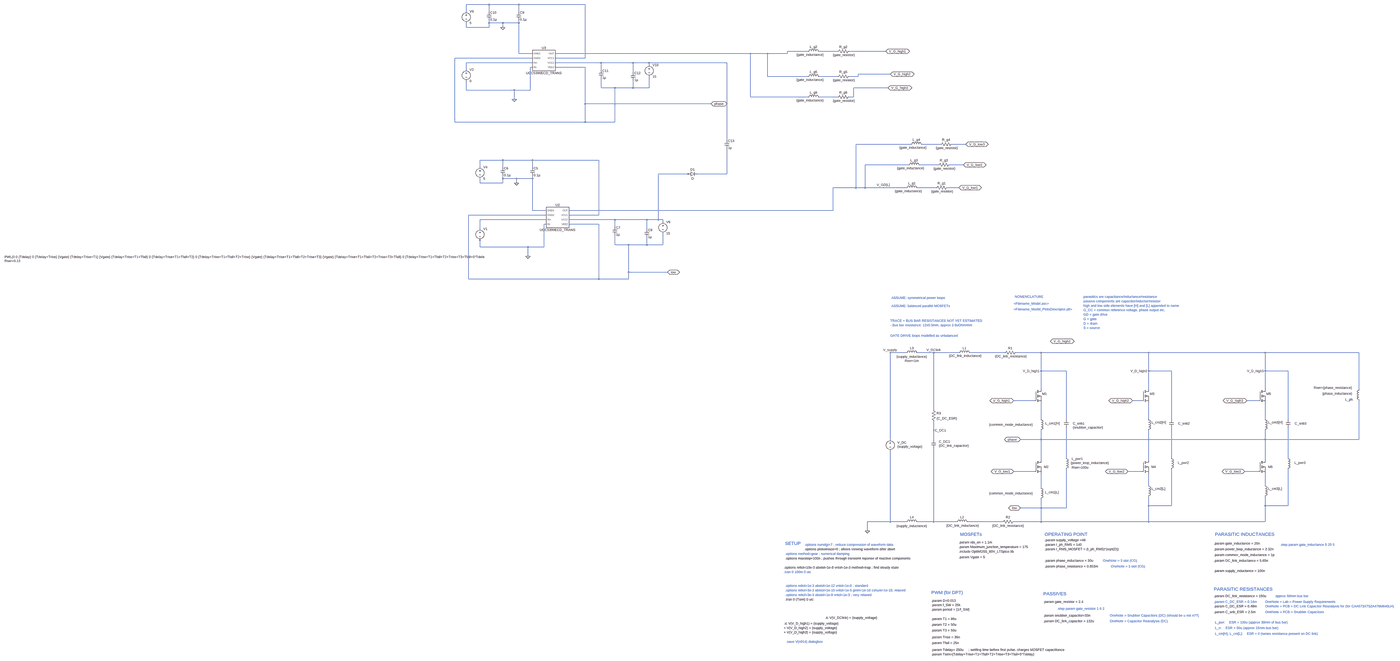
[diagram p0: schematic double_pulse_setup_including_gate_driver_circuitry_isolatedgrounds.asc, whole sheet]
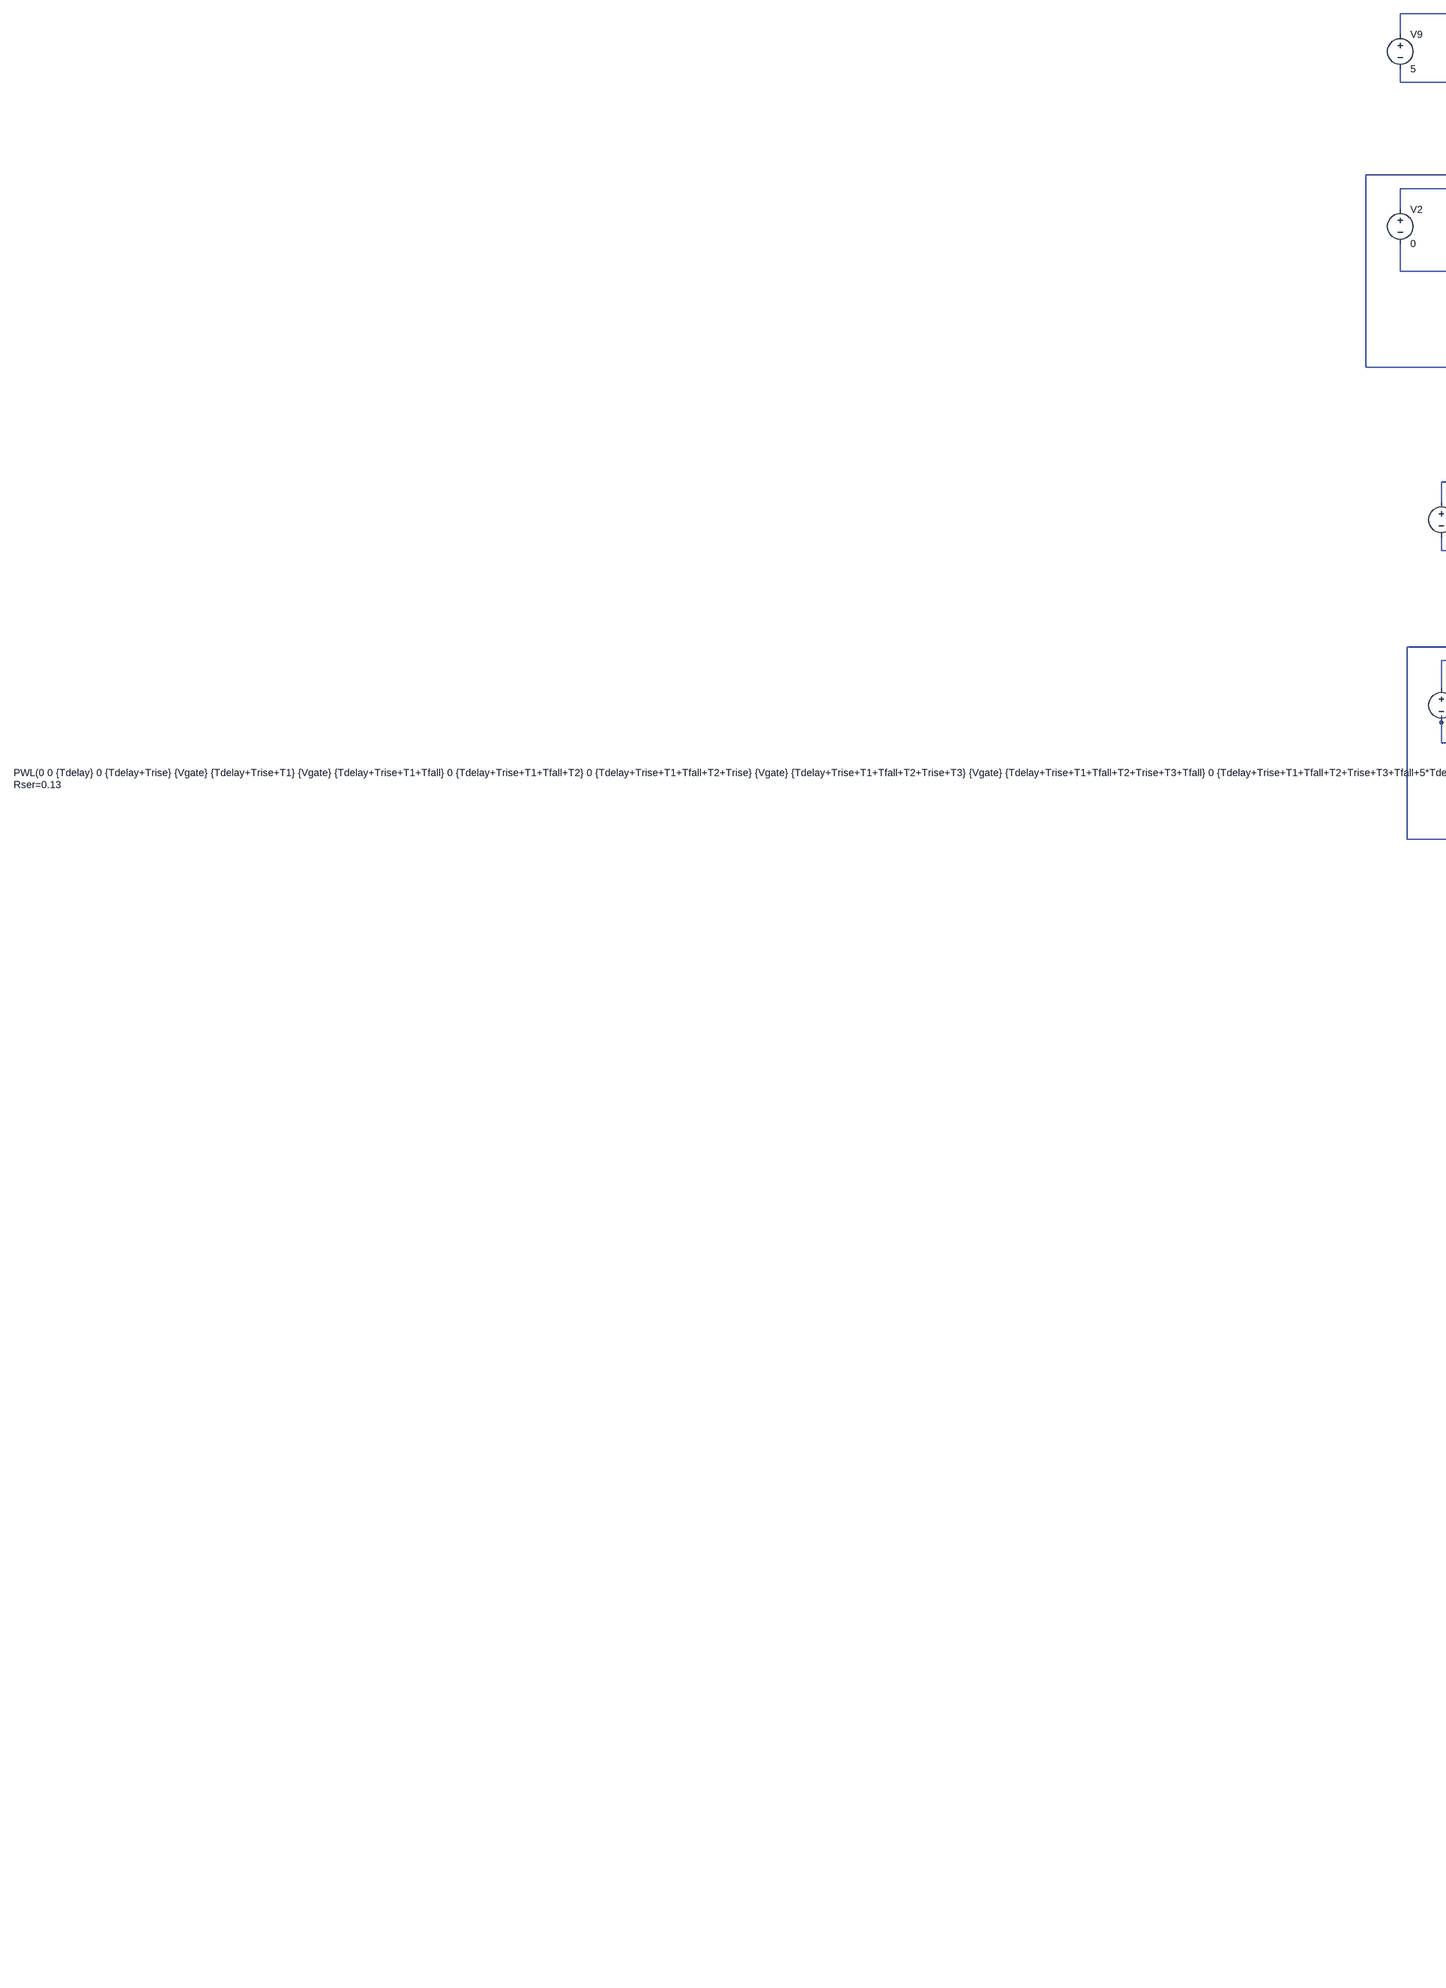
[diagram p1: schematic double_pulse_setup_including_gate_driver_circuitry_isolatedgrounds.asc, part, row 1 of 1, column 1 of 3]
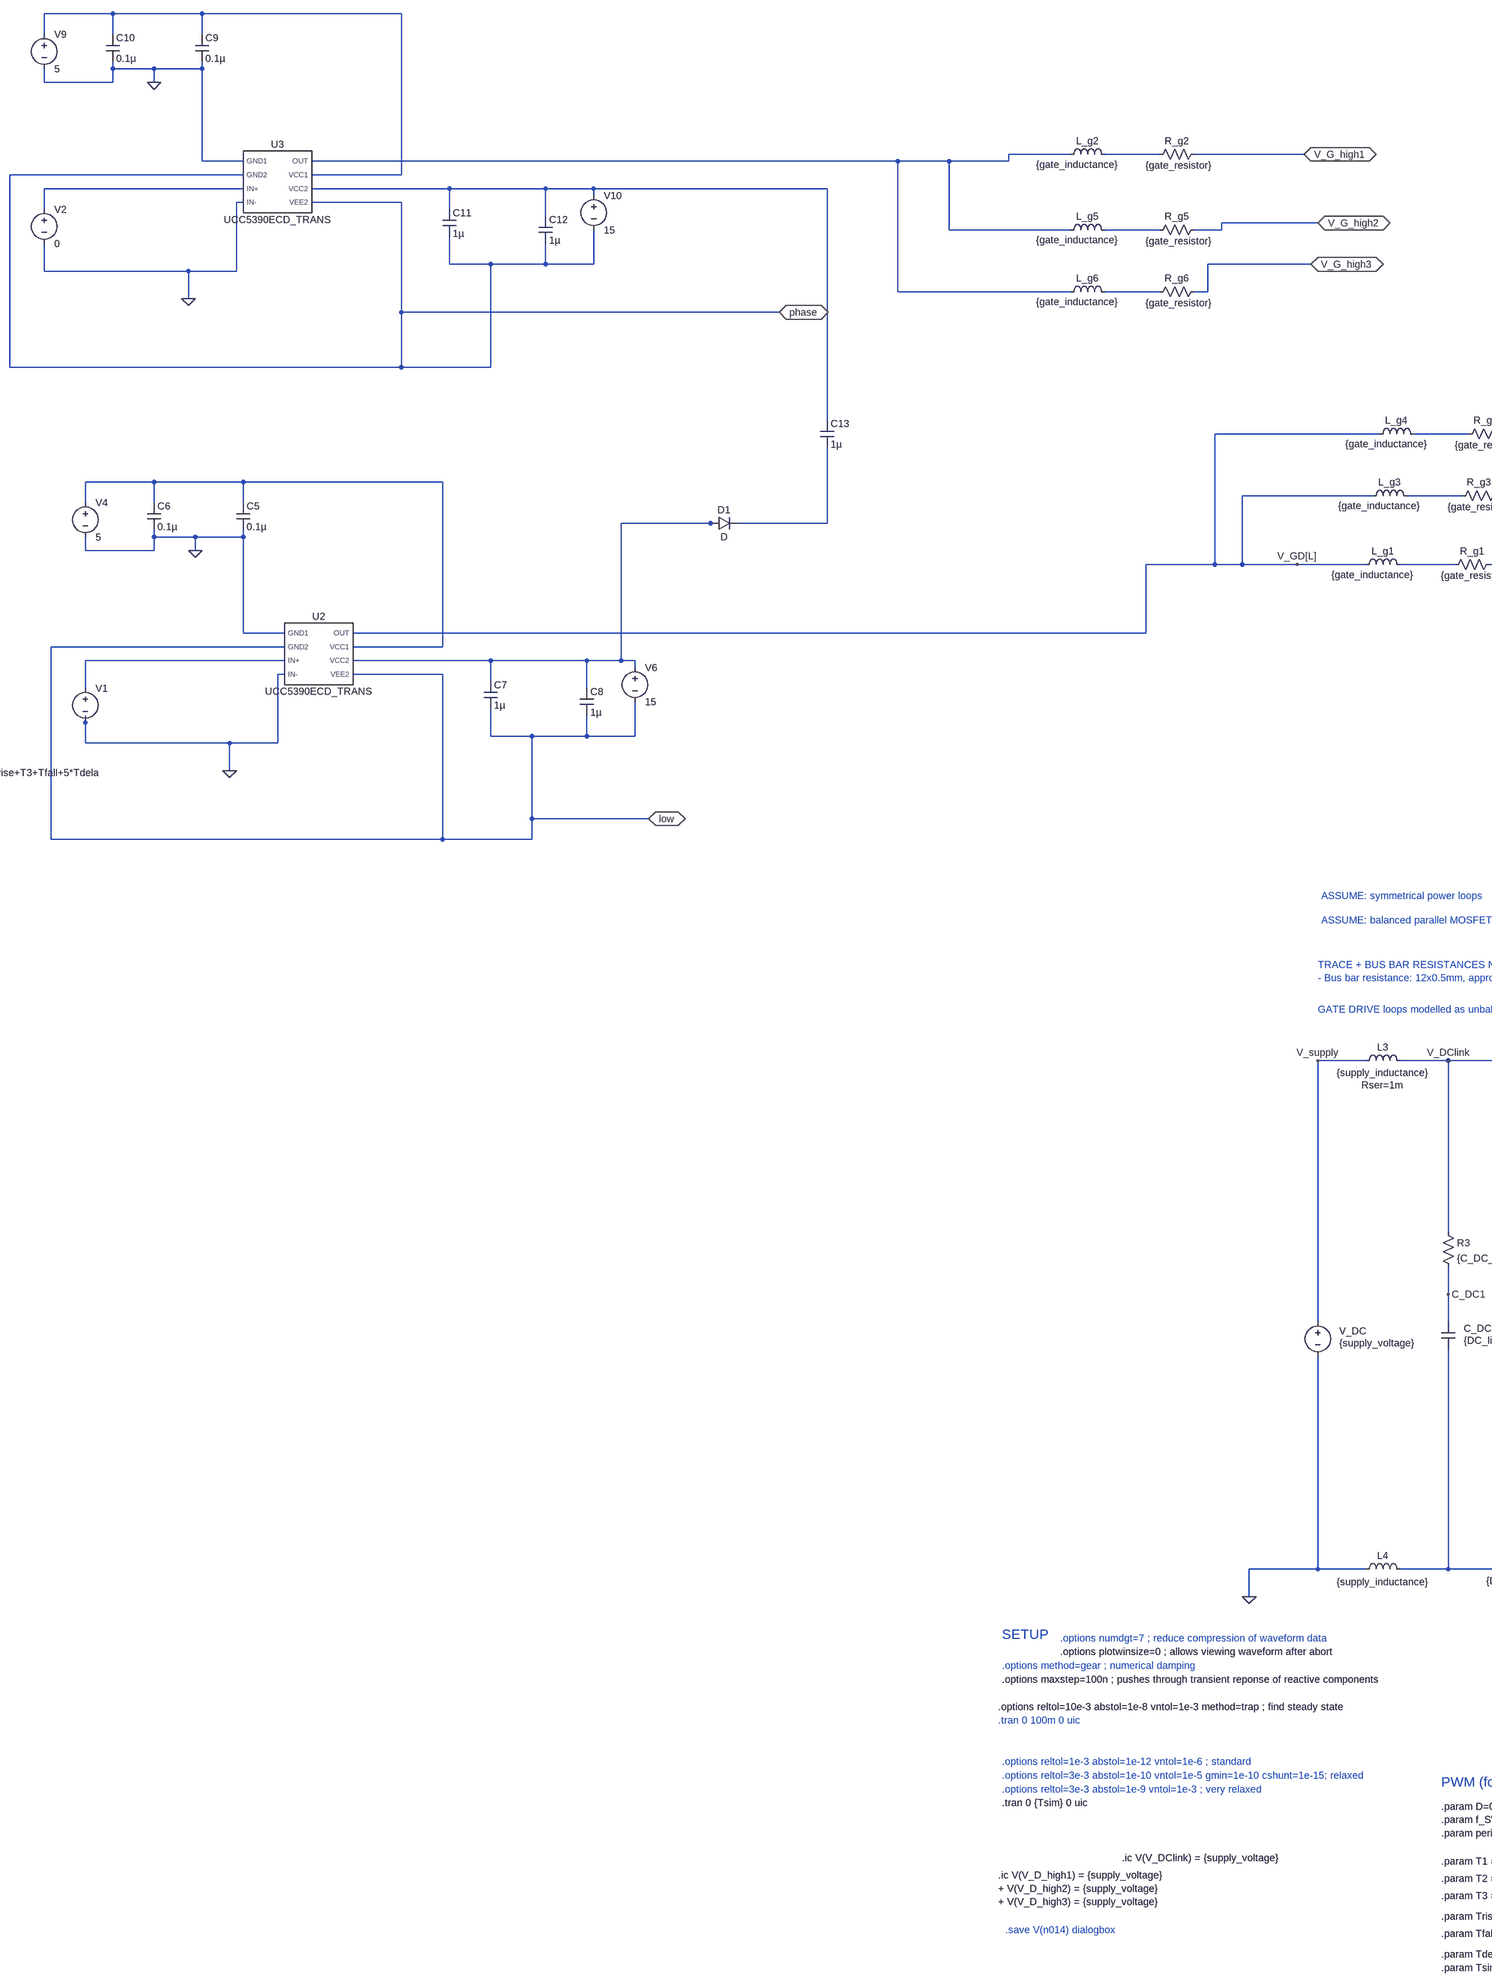
[diagram p2: schematic double_pulse_setup_including_gate_driver_circuitry_isolatedgrounds.asc, part, row 1 of 1, column 2 of 3]
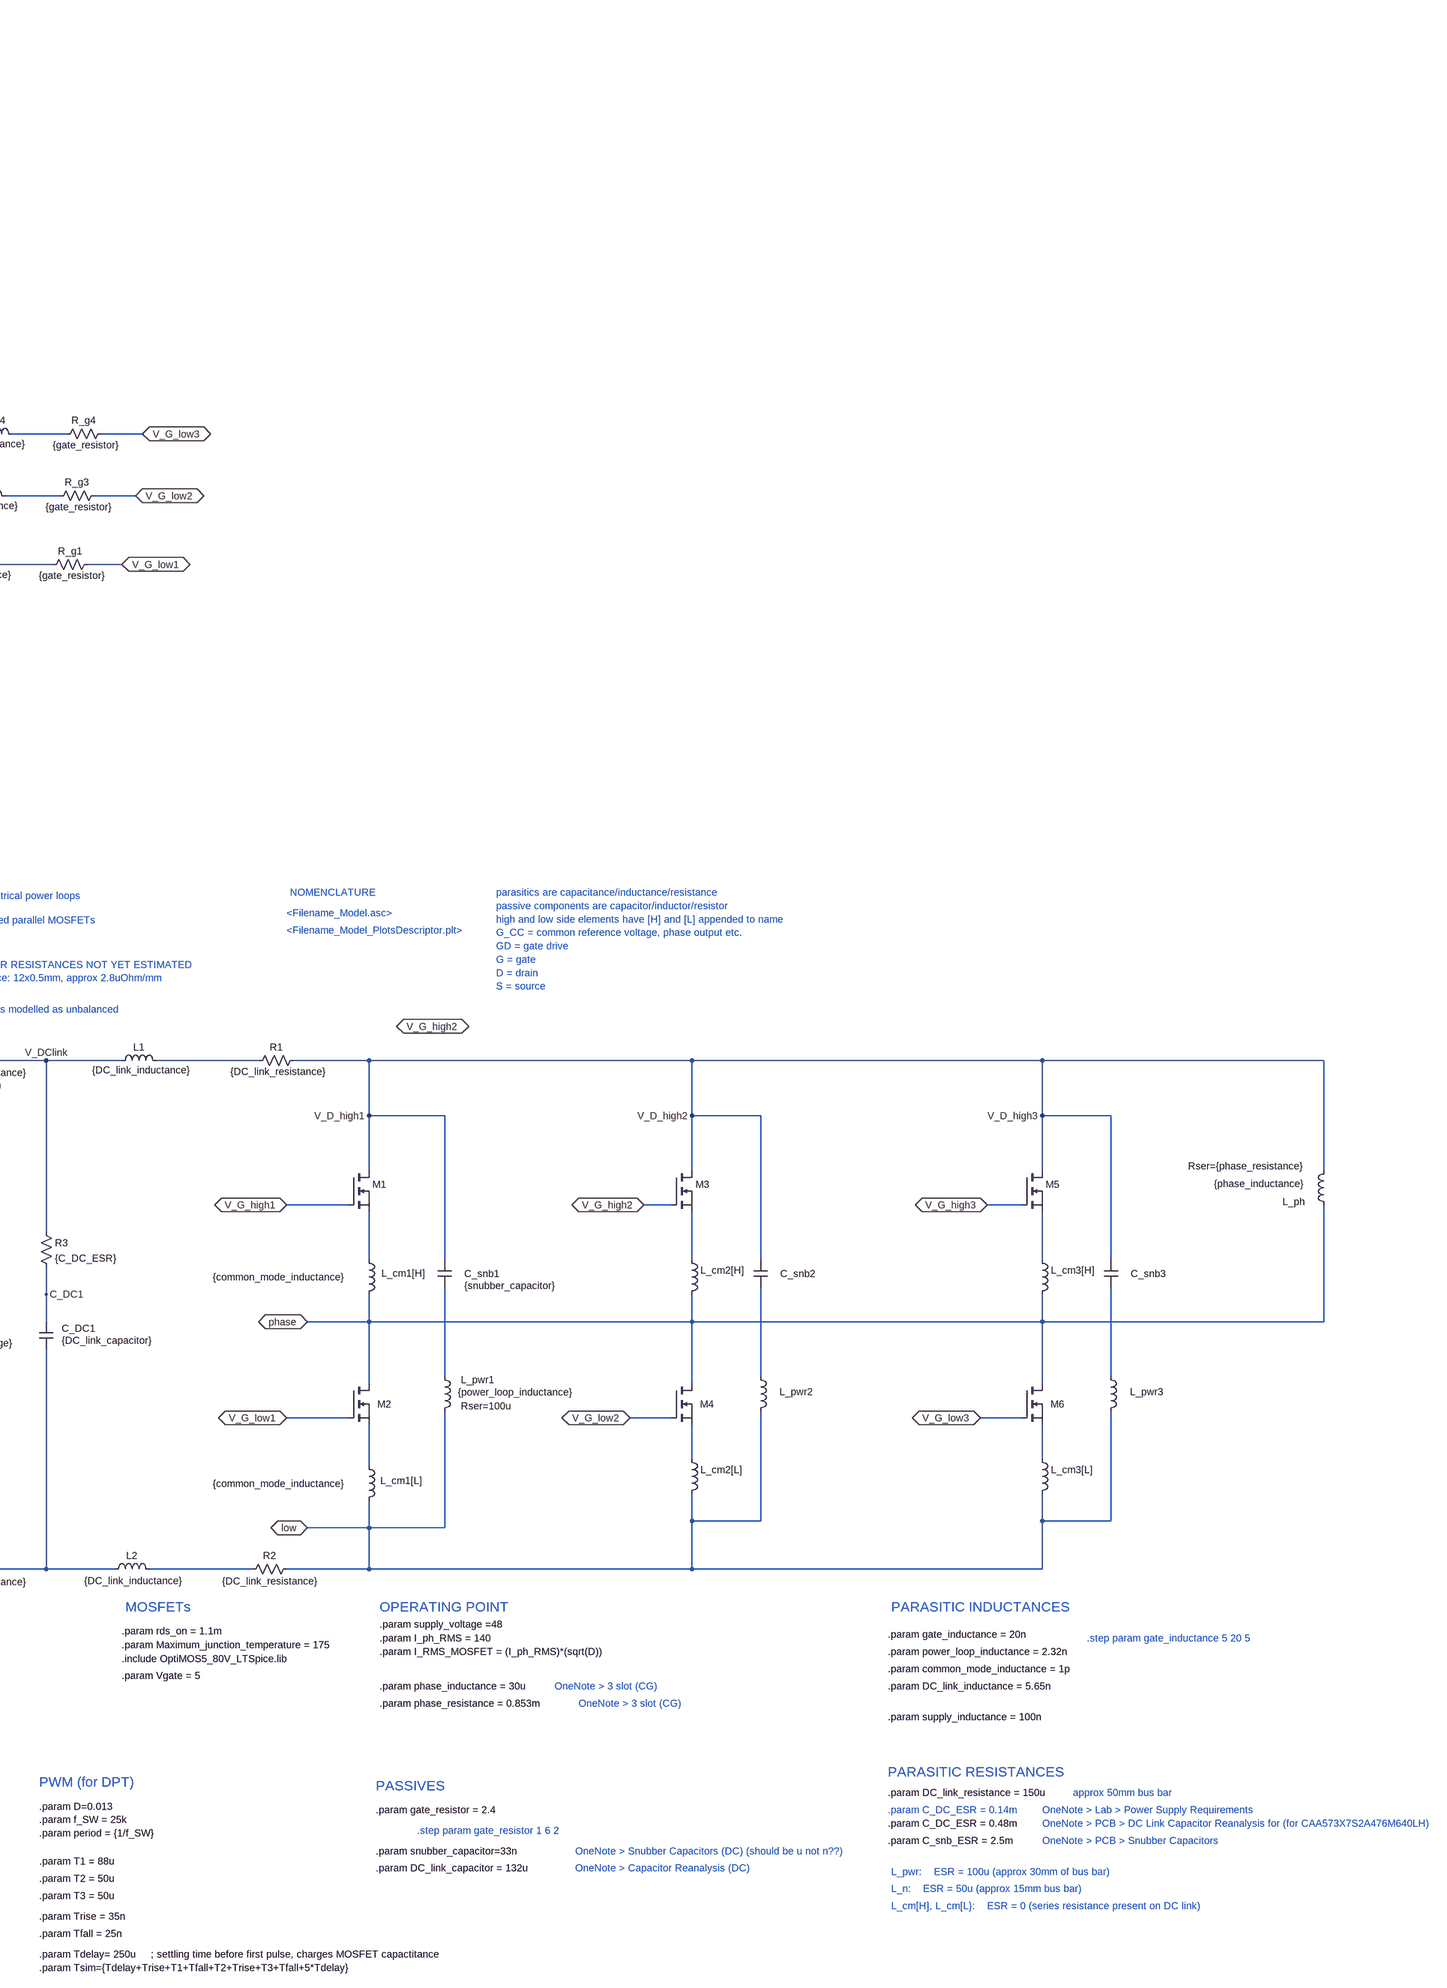
[diagram p3: schematic double_pulse_setup_including_gate_driver_circuitry_isolatedgrounds.asc, part, row 1 of 1, column 3 of 3]
double_pulse_setup_including_gate_driver_circuitry_isolatedgrounds.asc, the LTspice schematic file:
Version 4.1
SHEET 1 7948 3392
WIRE -1856 -3680 -2016 -3680
WIRE -1648 -3680 -1856 -3680
WIRE -1184 -3680 -1648 -3680
WIRE -2016 -3632 -2016 -3680
WIRE -1856 -3632 -1856 -3680
WIRE -1648 -3632 -1648 -3680
WIRE -1856 -3552 -1856 -3568
WIRE -1760 -3552 -1856 -3552
WIRE -1648 -3552 -1648 -3568
WIRE -1648 -3552 -1760 -3552
WIRE -2016 -3520 -2016 -3552
WIRE -1856 -3520 -1856 -3552
WIRE -1856 -3520 -2016 -3520
WIRE -1760 -3520 -1760 -3552
WIRE 448 -3344 304 -3344
WIRE 656 -3344 528 -3344
WIRE 992 -3344 736 -3344
WIRE -1648 -3328 -1648 -3552
WIRE -1552 -3328 -1648 -3328
WIRE 16 -3328 -1392 -3328
WIRE 160 -3328 16 -3328
WIRE 304 -3328 304 -3344
WIRE 304 -3328 160 -3328
WIRE -1552 -3296 -2096 -3296
WIRE -1184 -3296 -1184 -3680
WIRE -1184 -3296 -1392 -3296
WIRE -1552 -3264 -2016 -3264
WIRE -1072 -3264 -1392 -3264
WIRE -848 -3264 -1072 -3264
WIRE -736 -3264 -848 -3264
WIRE -192 -3264 -736 -3264
WIRE -736 -3248 -736 -3264
WIRE -1552 -3232 -1568 -3232
WIRE -1184 -3232 -1392 -3232
WIRE -2016 -3216 -2016 -3264
WIRE -1072 -3216 -1072 -3264
WIRE -848 -3200 -848 -3264
WIRE 1024 -3184 800 -3184
WIRE 160 -3168 160 -3328
WIRE 448 -3168 160 -3168
WIRE 656 -3168 528 -3168
WIRE 800 -3168 800 -3184
WIRE 800 -3168 736 -3168
WIRE -1072 -3088 -1072 -3152
WIRE -976 -3088 -1072 -3088
WIRE -848 -3088 -848 -3136
WIRE -848 -3088 -976 -3088
WIRE -736 -3088 -736 -3168
WIRE -736 -3088 -848 -3088
WIRE 1008 -3088 768 -3088
WIRE -2016 -3072 -2016 -3136
WIRE -1680 -3072 -2016 -3072
WIRE -1568 -3072 -1568 -3232
WIRE -1568 -3072 -1680 -3072
WIRE 16 -3024 16 -3328
WIRE 448 -3024 16 -3024
WIRE 656 -3024 528 -3024
WIRE 768 -3024 768 -3088
WIRE 768 -3024 736 -3024
WIRE -1680 -3008 -1680 -3072
WIRE -1184 -2976 -1184 -3232
WIRE -304 -2976 -1184 -2976
WIRE -2096 -2848 -2096 -3296
WIRE -1184 -2848 -1184 -2976
WIRE -1184 -2848 -2096 -2848
WIRE -976 -2848 -976 -3088
WIRE -976 -2848 -1184 -2848
WIRE -192 -2608 -192 -3264
WIRE 1168 -2576 784 -2576
WIRE 1376 -2576 1248 -2576
WIRE 1552 -2576 1456 -2576
WIRE -1760 -2464 -1920 -2464
WIRE -1552 -2464 -1760 -2464
WIRE -1088 -2464 -1552 -2464
WIRE 1152 -2432 848 -2432
WIRE 1360 -2432 1232 -2432
WIRE 1536 -2432 1440 -2432
WIRE -1920 -2416 -1920 -2464
WIRE -1760 -2416 -1760 -2464
WIRE -1552 -2416 -1552 -2464
WIRE -464 -2368 -672 -2368
WIRE -448 -2368 -464 -2368
WIRE -192 -2368 -192 -2544
WIRE -192 -2368 -400 -2368
WIRE -1760 -2336 -1760 -2352
WIRE -1664 -2336 -1760 -2336
WIRE -1552 -2336 -1552 -2352
WIRE -1552 -2336 -1664 -2336
WIRE -1920 -2304 -1920 -2336
WIRE -1760 -2304 -1760 -2336
WIRE -1760 -2304 -1920 -2304
WIRE -1664 -2304 -1664 -2336
WIRE 784 -2272 784 -2576
WIRE 784 -2272 624 -2272
WIRE 848 -2272 848 -2432
WIRE 848 -2272 784 -2272
WIRE 976 -2272 848 -2272
WIRE 1136 -2272 976 -2272
WIRE 1344 -2272 1216 -2272
WIRE 1504 -2272 1424 -2272
WIRE -1552 -2112 -1552 -2336
WIRE -1456 -2112 -1552 -2112
WIRE 624 -2112 624 -2272
WIRE 624 -2112 -1296 -2112
WIRE -1456 -2080 -2000 -2080
WIRE -1088 -2080 -1088 -2464
WIRE -1088 -2080 -1296 -2080
WIRE -1456 -2048 -1920 -2048
WIRE -976 -2048 -1296 -2048
WIRE -752 -2048 -976 -2048
WIRE -672 -2048 -672 -2368
WIRE -672 -2048 -752 -2048
WIRE -640 -2048 -672 -2048
WIRE -640 -2032 -640 -2048
WIRE -1456 -2016 -1472 -2016
WIRE -1088 -2016 -1296 -2016
WIRE -976 -2000 -976 -2048
WIRE -1920 -1984 -1920 -2048
WIRE -752 -1984 -752 -2048
WIRE -1920 -1904 -1920 -1920
WIRE -976 -1872 -976 -1936
WIRE -880 -1872 -976 -1872
WIRE -752 -1872 -752 -1920
WIRE -752 -1872 -880 -1872
WIRE -640 -1872 -640 -1952
WIRE -640 -1872 -752 -1872
WIRE -1920 -1856 -1920 -1904
WIRE -1584 -1856 -1920 -1856
WIRE -1472 -1856 -1472 -2016
WIRE -1472 -1856 -1584 -1856
WIRE -1584 -1792 -1584 -1856
WIRE -880 -1680 -880 -1872
WIRE -608 -1680 -880 -1680
WIRE -2000 -1632 -2000 -2080
WIRE -1088 -1632 -1088 -2016
WIRE -1088 -1632 -2000 -1632
WIRE -880 -1632 -880 -1680
WIRE -880 -1632 -1088 -1632
WIRE 1136 -928 1024 -928
WIRE 1328 -928 1216 -928
WIRE 1504 -928 1328 -928
WIRE 1824 -928 1584 -928
WIRE 2080 -928 1904 -928
WIRE 2832 -928 2080 -928
WIRE 3648 -928 2832 -928
WIRE 4304 -928 3648 -928
WIRE 2080 -800 2080 -928
WIRE 2256 -800 2080 -800
WIRE 2832 -800 2832 -928
WIRE 2992 -800 2832 -800
WIRE 3648 -800 3648 -928
WIRE 3808 -800 3648 -800
WIRE 2080 -672 2080 -800
WIRE 2832 -672 2832 -800
WIRE 3648 -672 3648 -800
WIRE 4304 -672 4304 -928
WIRE 2032 -592 1888 -592
WIRE 2080 -592 2080 -608
WIRE 2784 -592 2720 -592
WIRE 2832 -592 2832 -608
WIRE 3600 -592 3520 -592
WIRE 3648 -592 3648 -608
WIRE 1328 -528 1328 -928
WIRE 2080 -464 2080 -576
WIRE 2256 -464 2256 -800
WIRE 2832 -464 2832 -576
WIRE 2992 -464 2992 -800
WIRE 3648 -464 3648 -576
WIRE 3808 -464 3808 -800
WIRE 1328 -384 1328 -448
WIRE 1024 -320 1024 -928
WIRE 1328 -320 1328 -384
WIRE 2080 -320 2080 -384
WIRE 2080 -320 1936 -320
WIRE 2832 -320 2832 -384
WIRE 2832 -320 2080 -320
WIRE 3648 -320 3648 -384
WIRE 3648 -320 2832 -320
WIRE 4304 -320 4304 -592
WIRE 4304 -320 3648 -320
WIRE 2256 -192 2256 -400
WIRE 2992 -192 2992 -400
WIRE 3808 -192 3808 -400
WIRE 2080 -176 2080 -320
WIRE 2832 -176 2832 -320
WIRE 3648 -176 3648 -320
WIRE 2032 -96 1888 -96
WIRE 2784 -96 2688 -96
WIRE 3600 -96 3504 -96
WIRE 2832 0 2832 -80
WIRE 3648 0 3648 -80
WIRE 2080 16 2080 -80
WIRE 2832 144 2832 80
WIRE 2992 144 2992 -112
WIRE 2992 144 2832 144
WIRE 3648 144 3648 80
WIRE 3808 144 3808 -112
WIRE 3808 144 3648 144
WIRE 2080 160 2080 96
WIRE 2080 160 1936 160
WIRE 2256 160 2256 -112
WIRE 2256 160 2080 160
WIRE 1024 256 1024 -240
WIRE 1024 256 864 256
WIRE 1136 256 1024 256
WIRE 1328 256 1328 -256
WIRE 1328 256 1216 256
WIRE 1488 256 1328 256
WIRE 1808 256 1568 256
WIRE 2080 256 2080 160
WIRE 2080 256 1888 256
WIRE 2832 256 2832 144
WIRE 2832 256 2080 256
WIRE 3648 256 3648 144
WIRE 3648 256 2832 256
WIRE 864 320 864 256
FLAG 992 -3344 V_G_high1
IOPIN 992 -3344 BiDir
FLAG 1504 -2272 V_G_low1
IOPIN 1504 -2272 BiDir
FLAG 1888 -592 V_G_high1
IOPIN 1888 -592 BiDir
FLAG 1888 -96 V_G_low1
IOPIN 1888 -96 BiDir
FLAG 864 320 0
FLAG 1936 -320 phase
IOPIN 1936 -320 BiDir
FLAG -304 -2976 phase
IOPIN -304 -2976 BiDir
FLAG 2080 -800 V_D_high1
FLAG 976 -2272 V_GD[L]
FLAG 1328 -928 V_DClink
FLAG 2720 -592 V_G_high2
IOPIN 2720 -592 BiDir
FLAG -608 -1680 low
IOPIN -608 -1680 BiDir
FLAG 2688 -96 V_G_low2
IOPIN 2688 -96 BiDir
FLAG 3504 -96 V_G_low3
IOPIN 3504 -96 BiDir
FLAG 3520 -592 V_G_high3
IOPIN 3520 -592 BiDir
FLAG 1328 -384 C_DC1
FLAG 1024 -928 V_supply
FLAG 2832 -800 V_D_high2
FLAG 3648 -800 V_D_high3
FLAG 1936 160 low
IOPIN 1936 160 BiDir
FLAG -1664 -2304 0
FLAG -1584 -1792 0
FLAG -1760 -3520 0
FLAG -1680 -3008 0
FLAG 1536 -2432 V_G_low2
IOPIN 1536 -2432 BiDir
FLAG 1552 -2576 V_G_low3
IOPIN 1552 -2576 BiDir
FLAG 2144 -1008 V_G_high2
IOPIN 2144 -1008 BiDir
FLAG 1024 -3184 V_G_high2
IOPIN 1024 -3184 BiDir
FLAG 1008 -3088 V_G_high3
IOPIN 1008 -3088 BiDir
SYMBOL voltage 1024 -336 R0
WINDOW 3 50 65 Left 2
WINDOW 0 50 37 Left 2
WINDOW 123 0 0 Left 0
SYMATTR Value {supply_voltage}
SYMATTR InstName V_DC
SYMATTR SpiceLine Rser=0
SYMBOL cap 1312 -320 R0
WINDOW 0 52 15 Left 2
WINDOW 3 52 43 Left 2
SYMATTR InstName C_DC1
SYMATTR Value {DC_link_capacitor}
SYMATTR SpiceLine Rser=0
SYMBOL cap 2240 -464 R0
WINDOW 0 62 32 Left 2
WINDOW 3 62 60 Left 2
SYMATTR InstName C_snb1
SYMATTR Value {snubber_capacitor}
SYMATTR SpiceLine Rser=0
SYMBOL ind 4320 -576 R180
WINDOW 0 58 24 Left 2
WINDOW 3 59 66 Left 2
WINDOW 39 61 107 Left 2
SYMATTR InstName L_ph
SYMATTR Value {phase_inductance}
SYMATTR SpiceLine Rser={phase_resistance}
SYMBOL nmos 2032 -672 R0
WINDOW 3 56 72 Invisible 2
SYMATTR Value IPTG011N08NM5_L0
SYMATTR InstName M1
SYMATTR Prefix X
SYMBOL nmos 2032 -176 R0
WINDOW 0 67 48 Left 2
WINDOW 3 56 72 Invisible 2
SYMATTR InstName M2
SYMATTR Value IPTG011N08NM5_L0
SYMATTR Prefix X
SYMBOL ind 2064 -480 R0
WINDOW 3 -348 56 Left 2
WINDOW 0 45 47 Left 2
SYMATTR Value {common_mode_inductance}
SYMATTR InstName L_cm1[H]
SYMATTR SpiceLine Rser=0
SYMBOL ind 2064 0 R0
WINDOW 3 -348 57 Left 2
WINDOW 0 42 50 Left 2
SYMATTR Value {common_mode_inductance}
SYMATTR InstName L_cm1[L]
SYMATTR SpiceLine Rser=0
SYMBOL ind 2240 -208 R0
WINDOW 0 54 23 Left 2
WINDOW 3 47 52 Left 2
WINDOW 39 54 84 Left 2
SYMATTR InstName L_pwr1
SYMATTR Value {power_loop_inductance}
SYMATTR SpiceLine Rser=100u
SYMBOL cap 2976 -464 R0
WINDOW 0 62 32 Left 2
WINDOW 3 24 56 Invisible 2
SYMATTR InstName C_snb2
SYMATTR Value {snubber_capacitor}
SYMBOL nmos 2784 -672 R0
WINDOW 3 56 72 Invisible 2
SYMATTR Value IPTG011N08NM5_L0
SYMATTR InstName M3
SYMATTR Prefix X
SYMBOL nmos 2784 -176 R0
WINDOW 0 67 48 Left 2
WINDOW 3 56 72 Invisible 2
SYMATTR InstName M4
SYMATTR Value IPTG011N08NM5_L0
SYMATTR Prefix X
SYMBOL ind 2816 -480 R0
WINDOW 3 36 80 Invisible 2
SYMATTR Value {common_mode_inductance}
SYMATTR InstName L_cm2[H]
SYMATTR SpiceLine Rser=0
SYMBOL ind 2816 -16 R0
WINDOW 3 36 80 Invisible 2
SYMATTR Value {common_mode_inductance}
SYMATTR InstName L_cm2[L]
SYMATTR SpiceLine Rser=0
SYMBOL ind 2976 -208 R0
WINDOW 0 60 51 Left 2
WINDOW 3 36 80 Invisible 2
SYMATTR InstName L_pwr2
SYMATTR Value {power_loop_inductance}
SYMATTR SpiceLine Rser=100u
SYMBOL cap 3792 -464 R0
WINDOW 0 62 32 Left 2
WINDOW 3 24 56 Invisible 2
SYMATTR InstName C_snb3
SYMATTR Value {snubber_capacitor}
SYMBOL nmos 3600 -672 R0
WINDOW 3 56 72 Invisible 2
SYMATTR Value IPTG011N08NM5_L0
SYMATTR InstName M5
SYMATTR Prefix X
SYMBOL nmos 3600 -176 R0
WINDOW 0 67 48 Left 2
WINDOW 3 56 72 Invisible 2
SYMATTR InstName M6
SYMATTR Value IPTG011N08NM5_L0
SYMATTR Prefix X
SYMBOL ind 3632 -480 R0
WINDOW 3 36 80 Invisible 2
SYMATTR Value {common_mode_inductance}
SYMATTR InstName L_cm3[H]
SYMATTR SpiceLine Rser=0
SYMBOL ind 3632 -16 R0
WINDOW 3 36 80 Invisible 2
SYMATTR Value {common_mode_inductance}
SYMATTR InstName L_cm3[L]
SYMATTR SpiceLine Rser=0
SYMBOL ind 3792 -208 R0
WINDOW 0 60 51 Left 2
WINDOW 3 36 80 Invisible 2
SYMATTR InstName L_pwr3
SYMATTR Value {power_loop_inductance}
SYMATTR SpiceLine Rser=100u
SYMBOL ind 1488 -912 R270
WINDOW 0 32 56 VTop 2
WINDOW 3 -21 62 VTop 2
SYMATTR InstName L1
SYMATTR Value {DC_link_inductance}
SYMATTR SpiceLine Rser=0
SYMBOL ind 1472 272 R270
WINDOW 0 32 56 VTop 2
WINDOW 3 -26 60 VTop 2
SYMATTR InstName L2
SYMATTR Value {DC_link_inductance}
SYMATTR SpiceLine Rser=0
SYMBOL res 1920 -944 R90
WINDOW 0 0 56 VBottom 2
WINDOW 3 57 51 VBottom 2
SYMATTR InstName R1
SYMATTR Value {DC_link_resistance}
SYMBOL res 1904 240 R90
WINDOW 0 0 56 VBottom 2
WINDOW 3 59 54 VBottom 2
SYMATTR InstName R2
SYMATTR Value {DC_link_resistance}
SYMBOL ind 1120 -912 R270
WINDOW 0 32 56 VTop 2
WINDOW 3 -27 56 VTop 2
WINDOW 39 -56 55 VTop 2
SYMATTR InstName L3
SYMATTR Value {supply_inductance}
SYMATTR SpiceLine Rser=1m
SYMBOL ind 1120 272 R270
WINDOW 0 32 56 VTop 2
WINDOW 3 -29 56 VTop 2
SYMATTR InstName L4
SYMATTR Value {supply_inductance}
SYMATTR SpiceLine Rser=1m
SYMBOL res 1312 -544 R0
SYMATTR InstName R3
SYMATTR Value {C_DC_ESR}
SYMBOL ind 1120 -2256 R270
WINDOW 0 32 56 VTop 2
WINDOW 3 -23 33 VTop 2
SYMATTR InstName L_g1
SYMATTR Value {gate_inductance}
SYMATTR SpiceLine Rser=0
SYMBOL res 1328 -2256 R270
WINDOW 0 32 56 VTop 2
WINDOW 3 -25 61 VTop 2
SYMATTR InstName R_g1
SYMATTR Value {gate_resistor}
SYMBOL UCC5390ECD_TRANS -1376 -2064 R0
SYMATTR InstName U2
SYMBOL voltage -1920 -2432 R0
WINDOW 123 0 0 Left 0
WINDOW 39 0 0 Left 0
SYMATTR InstName V4
SYMATTR Value 5
SYMBOL voltage -640 -2048 R0
WINDOW 123 0 0 Left 0
WINDOW 39 0 0 Left 0
SYMATTR InstName V6
SYMATTR Value 15
SYMBOL cap -1568 -2416 R0
SYMATTR InstName C5
SYMATTR Value 0.1µ
SYMBOL cap -1776 -2416 R0
SYMATTR InstName C6
SYMATTR Value 0.1µ
SYMBOL cap -992 -2000 R0
SYMATTR InstName C7
SYMATTR Value 1µ
SYMBOL cap -768 -1984 R0
SYMATTR InstName C8
SYMATTR Value 1µ
SYMBOL UCC5390ECD_TRANS -1472 -3280 R0
SYMATTR InstName U3
SYMBOL voltage -2016 -3648 R0
WINDOW 123 0 0 Left 0
WINDOW 39 0 0 Left 0
SYMATTR InstName V9
SYMATTR Value 5
SYMBOL voltage -736 -3264 R0
WINDOW 123 0 0 Left 0
WINDOW 39 0 0 Left 0
SYMATTR InstName V10
SYMATTR Value 15
SYMBOL cap -1664 -3632 R0
SYMATTR InstName C9
SYMATTR Value 0.1µ
SYMBOL cap -1872 -3632 R0
SYMATTR InstName C10
SYMATTR Value 0.1µ
SYMBOL cap -1088 -3216 R0
SYMATTR InstName C11
SYMATTR Value 1µ
SYMBOL cap -864 -3200 R0
SYMATTR InstName C12
SYMATTR Value 1µ
SYMBOL diode -464 -2352 R270
WINDOW 0 32 32 VTop 2
WINDOW 3 0 32 VBottom 2
SYMATTR InstName D1
SYMBOL cap -208 -2608 R0
SYMATTR InstName C13
SYMATTR Value 1µ
SYMBOL voltage -1920 -2000 R0
WINDOW 123 0 0 Left 0
WINDOW 39 -3326 241 Left 2
WINDOW 3 -3326 213 Left 2
SYMATTR SpiceLine Rser=0.13
SYMATTR Value PWL(0 0 {Tdelay} 0 {Tdelay+Trise} {Vgate} {Tdelay+Trise+T1} {Vgate} {Tdelay+Trise+T1+Tfall} 0 {Tdelay+Trise+T1+Tfall+T2} 0 {Tdelay+Trise+T1+Tfall+T2+Trise} {Vgate} {Tdelay+Trise+T1+Tfall+T2+Trise+T3} {Vgate} {Tdelay+Trise+T1+Tfall+T2+Trise+T3+Tfall} 0 {Tdelay+Trise+T1+Tfall+T2+Trise+T3+Tfall+5*Tdelay} 0)
SYMATTR InstName V1
SYMBOL ind 432 -3328 R270
WINDOW 0 32 56 VTop 2
WINDOW 3 -23 33 VTop 2
SYMATTR InstName L_g2
SYMATTR Value {gate_inductance}
SYMATTR SpiceLine Rser=0
SYMBOL res 640 -3328 R270
WINDOW 0 32 56 VTop 2
WINDOW 3 -25 61 VTop 2
SYMATTR InstName R_g2
SYMATTR Value {gate_resistor}
SYMBOL voltage -2016 -3232 R0
WINDOW 123 0 0 Left 0
WINDOW 39 0 0 Left 0
SYMATTR InstName V2
SYMATTR Value 0
SYMBOL ind 1136 -2416 R270
WINDOW 0 32 56 VTop 2
WINDOW 3 -23 33 VTop 2
SYMATTR InstName L_g3
SYMATTR Value {gate_inductance}
SYMATTR SpiceLine Rser=0
SYMBOL res 1344 -2416 R270
WINDOW 0 32 56 VTop 2
WINDOW 3 -25 61 VTop 2
SYMATTR InstName R_g3
SYMATTR Value {gate_resistor}
SYMBOL ind 1152 -2560 R270
WINDOW 0 32 56 VTop 2
WINDOW 3 -23 33 VTop 2
SYMATTR InstName L_g4
SYMATTR Value {gate_inductance}
SYMATTR SpiceLine Rser=0
SYMBOL res 1360 -2560 R270
WINDOW 0 32 56 VTop 2
WINDOW 3 -25 61 VTop 2
SYMATTR InstName R_g4
SYMATTR Value {gate_resistor}
SYMBOL ind 432 -3152 R270
WINDOW 0 32 56 VTop 2
WINDOW 3 -23 33 VTop 2
SYMATTR InstName L_g5
SYMATTR Value {gate_inductance}
SYMATTR SpiceLine Rser=0
SYMBOL res 640 -3152 R270
WINDOW 0 32 56 VTop 2
WINDOW 3 -25 61 VTop 2
SYMATTR InstName R_g5
SYMATTR Value {gate_resistor}
SYMBOL ind 432 -3008 R270
WINDOW 0 32 56 VTop 2
WINDOW 3 -23 33 VTop 2
SYMATTR InstName L_g6
SYMATTR Value {gate_inductance}
SYMATTR SpiceLine Rser=0
SYMBOL res 640 -3008 R270
WINDOW 0 32 56 VTop 2
WINDOW 3 -25 61 VTop 2
SYMATTR InstName R_g6
SYMATTR Value {gate_resistor}
TEXT 1312 808 Left 2 !.param D=0.013\n.param f_SW = 25k\n.param period = {1/f_SW}
TEXT 288 704 Left 2 ;.options reltol=1e-3 abstol=1e-12 vntol=1e-6 ; standard
TEXT 1504 464 Left 2 !.include OptiMOS5_80V_LTSpice.lib
TEXT 2096 912 Left 2 !.param snubber_capacitor=33n
TEXT 2096 952 Left 2 !.param DC_link_capacitor = 132u
TEXT 2104 384 Left 2 !.param supply_voltage =48
TEXT 2104 568 Left 2 !.param phase_resistance = 0.853m
TEXT 2104 528 Left 2 !.param phase_inductance = 30u
TEXT 2104 416 Left 2 !.param I_ph_RMS = 140
TEXT 2104 448 Left 2 !.param I_RMS_MOSFET = (I_ph_RMS)*(sqrt(D))
TEXT 1504 432 Left 2 !.param Maximum_junction_temperature = 175
TEXT 1504 400 Left 2 !.param rds_on = 1.1m
TEXT 3288 488 Left 2 !.param common_mode_inductance = 1p
TEXT 3288 448 Left 2 !.param power_loop_inductance = 2.32n
TEXT 2096 816 Left 2 !.param gate_resistor = 2.4
TEXT 3288 408 Left 2 !.param gate_inductance = 20n
TEXT 288 408 Left 3 ;SETUP
TEXT 1512 344 Left 3 ;MOSFETs
TEXT 2104 344 Left 3 ;OPERATING POINT
TEXT 3296 344 Left 3 ;PARASITIC INDUCTANCES
TEXT 2096 760 Left 3 ;PASSIVES
TEXT 1504 504 Left 2 !.param Vgate = 5
TEXT 2192 864 Left 2 ;.step param gate_resistor 1 6 2
TEXT 3288 528 Left 2 !.param DC_link_inductance = 5.65n
TEXT 1032 -1312 Left 2 ;ASSUME: symmetrical power loops
TEXT 1024 -1152 Left 2 ;TRACE + BUS BAR RESISTANCES NOT YET ESTIMATED\n- Bus bar resistance: 12x0.5mm, approx 2.8uOhm/mm
TEXT 1032 -1256 Left 2 ;ASSUME: balanced parallel MOSFETs
TEXT 280 608 Left 2 ;.tran 0 100m 0 uic
TEXT 1024 -1048 Left 2 ;GATE DRIVE loops modelled as unbalanced
TEXT 3288 600 Left 2 !.param supply_inductance = 100n
TEXT 3288 728 Left 3 ;PARASITIC RESISTANCES
TEXT 3288 776 Left 2 !.param DC_link_resistance = 150u
TEXT 3288 816 Left 2 ;.param C_DC_ESR = 0.14m
TEXT 2560 952 Left 2 ;OneNote > Capacitor Reanalysis (DC)
TEXT 2560 912 Left 2 ;OneNote > Snubber Capacitors (DC) (should be u not n??)
TEXT 2512 528 Left 2 ;OneNote > 3 slot (CG)
TEXT 2568 568 Left 2 ;OneNote > 3 slot (CG)
TEXT 424 448 Left 2 !.options plotwinsize=0 ; allows viewing waveform after abort
TEXT 2376 -1320 Left 2 ;parasitics are capacitance/inductance/resistance\npassive components are capacitor/inductor/resistor\nhigh and low side elements have [H] and [L] appended to name\nG_CC = common reference voltage, phase output etc.\nGD = gate drive\nG = gate\nD = drain\nS = source
TEXT 288 512 Left 2 !.options maxstep=100n ; pushes through transient reponse of reactive components
TEXT 288 768 Left 2 ;.options reltol=3e-3 abstol=1e-9 vntol=1e-3 ; very relaxed
TEXT 280 576 Left 2 !.options reltol=10e-3 abstol=1e-8 vntol=1e-3 method=trap ; find steady state
TEXT 1312 752 Left 3 ;PWM (for DPT)
TEXT 3296 960 Left 2 ;L_pwr:    ESR = 100u (approx 30mm of bus bar)
TEXT 3296 1040 Left 2 ;L_cm[H], L_cm[L}:    ESR = 0 (series resistance present on DC link)
TEXT 3296 1000 Left 2 ;L_n:    ESR = 50u (approx 15mm bus bar)
TEXT 3648 816 Left 2 ;OneNote > Lab > Power Supply Requirements
TEXT 3288 888 Left 2 !.param C_snb_ESR = 2.5m
TEXT 3288 848 Left 2 !.param C_DC_ESR = 0.48m
TEXT 3648 848 Left 2 ;OneNote > PCB > DC Link Capacitor Reanalysis for (for CAA573X7S2A476M640LH)
TEXT 3720 776 Left 2 ;approx 50mm bus bar
TEXT 3648 888 Left 2 ;OneNote > PCB > Snubber Capacitors
TEXT 1312 936 Left 2 !.param T1 = 88u
TEXT 1312 976 Left 2 !.param T2 = 50u
TEXT 1312 1016 Left 2 !.param T3 = 50u
TEXT 1312 1064 Left 2 !.param Trise = 35n
TEXT 1312 1104 Left 2 !.param Tfall = 25n
TEXT 1312 1184 Left 2 !.param Tsim={Tdelay+Trise+T1+Tfall+T2+Trise+T3+Tfall+5*Tdelay}
TEXT 288 800 Left 2 !.tran 0 {Tsim} 0 uic
TEXT 1312 1152 Left 2 !.param Tdelay= 250u     ; settling time before first pulse, charges MOSFET capactitance
TEXT 3752 416 Left 2 ;.step param gate_inductance 5 20 5
TEXT 288 480 Left 2 ;.options method=gear ; numerical damping
TEXT 288 736 Left 2 ;.options reltol=3e-3 abstol=1e-10 vntol=1e-5 gmin=1e-10 cshunt=1e-15; relaxed
TEXT 424 416 Left 2 ;.options numdgt=7 ; reduce compression of waveform data
TEXT 280 968 Left 2 !.ic V(V_D_high1) = {supply_voltage}\n+ V(V_D_high2) = {supply_voltage}\n+ V(V_D_high3) = {supply_voltage}
TEXT 296 1096 Left 2 ;.save V(n014) dialogbox
TEXT 568 928 Left 2 !.ic V(V_DClink) = {supply_voltage}
TEXT 1896 -1320 Left 2 ;NOMENCLATURE
TEXT 1888 -1272 Left 2 ;<Filename_Model.asc>
TEXT 1888 -1232 Left 2 ;<Filename_Model_PlotsDescriptor.plt>

The netlist it stands for:
* double_pulse_setup_including_gate_driver_circuitry_isolatedgrounds.asc
V_DC V_supply 0 {supply_voltage} Rser=0
C_DC1 C_DC1 N028 {DC_link_capacitor} Rser=0
C_snb1 V_D_high3 N022 {snubber_capacitor} Rser=0
L_ph phase V_D_high3 {phase_inductance} Rser={phase_resistance}
X§M1 V_D_high3 V_G_high1 N019 IPTG011N08NM5_L0  ; pins D G S
X§M2 phase V_G_low1 N027 IPTG011N08NM5_L0  ; pins D G S
L_cm1[H] N019 phase {common_mode_inductance} Rser=0
L_cm1[L] N027 low {common_mode_inductance} Rser=0
L_pwr1 N022 low {power_loop_inductance} Rser=100u
C_snb2 V_D_high3 N023 {snubber_capacitor}
X§M3 V_D_high3 V_G_high2 N020 IPTG011N08NM5_L0  ; pins D G S
X§M4 phase V_G_low2 N025 IPTG011N08NM5_L0  ; pins D G S
L_cm2[H] N020 phase {common_mode_inductance} Rser=0
L_cm2[L] N025 low {common_mode_inductance} Rser=0
L_pwr2 N023 low {power_loop_inductance} Rser=100u
C_snb3 V_D_high3 N024 {snubber_capacitor}
X§M5 V_D_high3 V_G_high3 N021 IPTG011N08NM5_L0  ; pins D G S
X§M6 phase V_G_low3 N026 IPTG011N08NM5_L0  ; pins D G S
L_cm3[H] N021 phase {common_mode_inductance} Rser=0
L_cm3[L] N026 low {common_mode_inductance} Rser=0
L_pwr3 N024 low {power_loop_inductance} Rser=100u
L1 V_DClink N015 {DC_link_inductance} Rser=0
L2 N028 N029 {DC_link_inductance} Rser=0
R1 V_D_high3 N015 {DC_link_resistance}
R2 low N029 {DC_link_resistance}
L3 V_supply V_DClink {supply_inductance} Rser=1m
L4 0 N028 {supply_inductance} Rser=1m
R3 V_DClink C_DC1 {C_DC_ESR}
L_g1 V_GD[L] N013 {gate_inductance} Rser=0
R_g1 N013 V_G_low1 {gate_resistor}
X§U2 0 low N014 0 V_GD[L] N009 N011 low UCC5390ECD_TRANS  ; pins GND1 GND2 IN+ IN- OUT VCC1 VCC2 VEE2
V4 N009 0 5
V6 N011 low 15
C5 N009 0 0.1µ
C6 N009 0 0.1µ
C7 N011 low 1µ
C8 N011 low 1µ
X§U3 0 phase N004 0 N002 N001 N005 phase UCC5390ECD_TRANS  ; pins GND1 GND2 IN+ IN- OUT VCC1 VCC2 VEE2
V9 N001 0 5
V10 N005 phase 15
C9 N001 0 0.1µ
C10 N001 0 0.1µ
C11 N005 phase 1µ
C12 N005 phase 1µ
D1 N011 N012 D
C13 N005 N012 1µ
V1 N014 0 PWL(0 0 {Tdelay} 0 {Tdelay+Trise} {Vgate} {Tdelay+Trise+T1} {Vgate} {Tdelay+Trise+T1+Tfall} 0 {Tdelay+Trise+T1+Tfall+T2} 0 {Tdelay+Trise+T1+Tfall+T2+Trise} {Vgate} {Tdelay+Trise+T1+Tfall+T2+Trise+T3} {Vgate} {Tdelay+Trise+T1+Tfall+T2+Trise+T3+Tfall} 0 {Tdelay+Trise+T1+Tfall+T2+Trise+T3+Tfall+5*Tdelay} 0) Rser=0.13
L_g2 N002 N003 {gate_inductance} Rser=0
R_g2 N003 V_G_high1 {gate_resistor}
V2 N004 0 0
L_g3 V_GD[L] N010 {gate_inductance} Rser=0
R_g3 N010 V_G_low2 {gate_resistor}
L_g4 V_GD[L] N008 {gate_inductance} Rser=0
R_g4 N008 V_G_low3 {gate_resistor}
L_g5 N002 N006 {gate_inductance} Rser=0
R_g5 N006 V_G_high2 {gate_resistor}
L_g6 N002 N007 {gate_inductance} Rser=0
R_g6 N007 V_G_high3 {gate_resistor}
.model D D
.lib standard.dio
.param D=0.013
.param f_SW = 25k
.param period = {1/f_SW}
* .options reltol=1e-3 abstol=1e-12 vntol=1e-6 ; standard
.include OptiMOS5_80V_LTSpice.lib
.param snubber_capacitor=33n
.param DC_link_capacitor = 132u
.param supply_voltage =48
.param phase_resistance = 0.853m
.param phase_inductance = 30u
.param I_ph_RMS = 140
.param I_RMS_MOSFET = (I_ph_RMS)*(sqrt(D))
.param Maximum_junction_temperature = 175
.param rds_on = 1.1m
.param common_mode_inductance = 1p
.param power_loop_inductance = 2.32n
.param gate_resistor = 2.4
.param gate_inductance = 20n
* SETUP
* MOSFETs
* OPERATING POINT
* PARASITIC INDUCTANCES
* PASSIVES
.param Vgate = 5
* .step param gate_resistor 1 6 2
.param DC_link_inductance = 5.65n
* ASSUME: symmetrical power loops
* TRACE + BUS BAR RESISTANCES NOT YET ESTIMATED
* - Bus bar resistance: 12x0.5mm, approx 2.8uOhm/mm
* ASSUME: balanced parallel MOSFETs
* .tran 0 100m 0 uic
* GATE DRIVE loops modelled as unbalanced
.param supply_inductance = 100n
* PARASITIC RESISTANCES
.param DC_link_resistance = 150u
* .param C_DC_ESR = 0.14m
* OneNote > Capacitor Reanalysis (DC)
* OneNote > Snubber Capacitors (DC) (should be u not n??)
* OneNote > 3 slot (CG)
* OneNote > 3 slot (CG)
.options plotwinsize=0 ; allows viewing waveform after abort
* parasitics are capacitance/inductance/resistance
* passive components are capacitor/inductor/resistor
* high and low side elements have [H] and [L] appended to name
* G_CC = common reference voltage, phase output etc.
* GD = gate drive
* G = gate
* D = drain
* S = source
.options maxstep=100n ; pushes through transient reponse of reactive components
* .options reltol=3e-3 abstol=1e-9 vntol=1e-3 ; very relaxed
.options reltol=10e-3 abstol=1e-8 vntol=1e-3 method=trap ; find steady state
* PWM (for DPT)
* L_pwr:    ESR = 100u (approx 30mm of bus bar)
* L_cm[H], L_cm[L}:    ESR = 0 (series resistance present on DC link)
* L_n:    ESR = 50u (approx 15mm bus bar)
* OneNote > Lab > Power Supply Requirements
.param C_snb_ESR = 2.5m
.param C_DC_ESR = 0.48m
* OneNote > PCB > DC Link Capacitor Reanalysis for (for CAA573X7S2A476M640LH)
* approx 50mm bus bar
* OneNote > PCB > Snubber Capacitors
.param T1 = 88u
.param T2 = 50u
.param T3 = 50u
.param Trise = 35n
.param Tfall = 25n
.param Tsim={Tdelay+Trise+T1+Tfall+T2+Trise+T3+Tfall+5*Tdelay}
.tran 0 {Tsim} 0 uic
.param Tdelay= 250u     ; settling time before first pulse, charges MOSFET capactitance
* .step param gate_inductance 5 20 5
* .options method=gear ; numerical damping
* .options reltol=3e-3 abstol=1e-10 vntol=1e-5 gmin=1e-10 cshunt=1e-15; relaxed
* .options numdgt=7 ; reduce compression of waveform data
.ic V(V_D_high1) = {supply_voltage}
+ V(V_D_high2) = {supply_voltage}
+ V(V_D_high3) = {supply_voltage}
* .save V(n014) dialogbox
.ic V(V_DClink) = {supply_voltage}
* NOMENCLATURE
* <Filename_Model.asc>
* <Filename_Model_PlotsDescriptor.plt>
.lib UCC5390ECD_TRANS.LIB
.backanno
.end